# Altium project Nav-HAT.PrjPcb
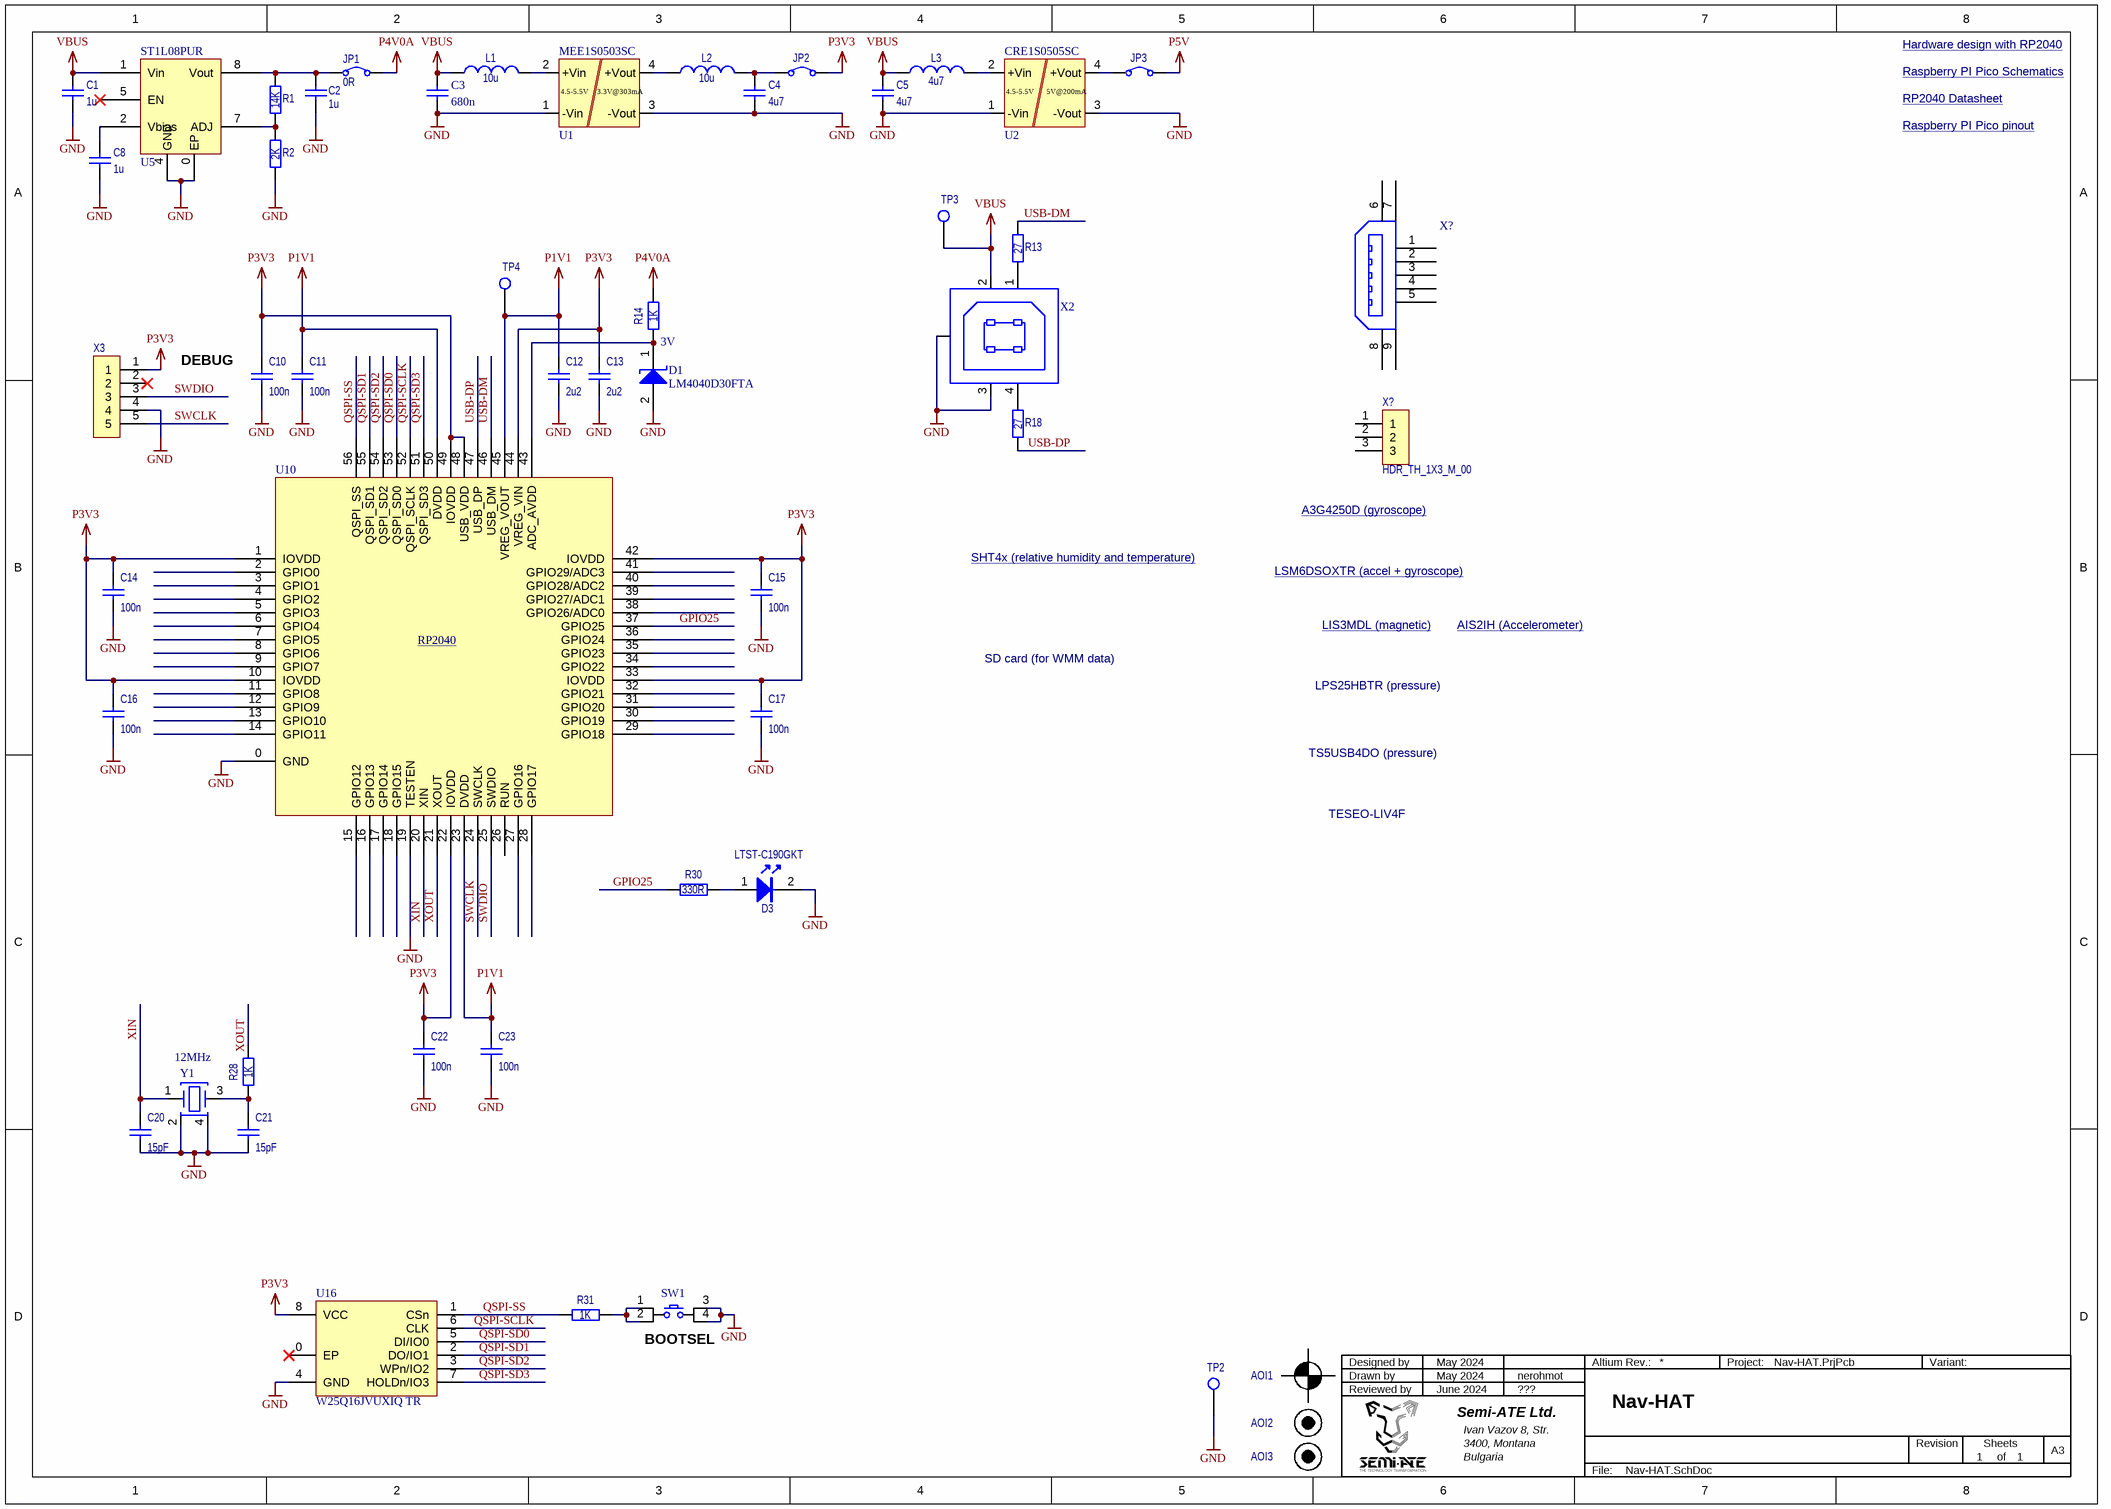
[diagram p0: Nav-HAT.SchDoc]
Project_Title: Nav-HAT; Engineer_Review: ???; Engineer_Drawn: nerohmot; Engineer_Desing: nerohmot; Date_Reviewed: June 2024; Date_Drawn: May 2024; Date_Designed: May 2024
1 sheet, 51 parts. Net scope: global (net labels, ports and power ports of the same name join across sheets).
Board file: Nav-HAT.PcbDoc

## Sheet Nav-HAT.SchDoc
size A3; SheetNumber: 1; SheetTotal: 1

### Parts
(Parts that share a designator on the sheet are numbered #1, #2 ... from top to bottom, then left to right.)
AOI1  FIDUCIAL_MARKER_CROSS  [FIDUCIAL_MARKER_CROSS]  (value not drawn)  (no BOM)
AOI2  FIDUCIAL_MARKER_POINT  [FIDUCIAL_MARKER_POINT]  (value not drawn)  (no BOM)
AOI3  FIDUCIAL_MARKER_POINT  [FIDUCIAL_MARKER_POINT]  (value not drawn)  (no BOM)
C1  value 1u  [CAPC0402]  (hidden comment: CL05A105KP5NNNC)
C2  value 1u  [CAPC0402]  (hidden comment: CL05A105KP5NNNC)
C3  value 680n  [CAPC0603]  (hidden comment: 680n_0603_25V_X7R_10%)
C4  value 4u7  [CAPC0402]  (hidden comment: CL05A475KP5NRNC)
C5  value 4u7  [CAPC0402]  (hidden comment: CL05A475KP5NRNC)
C8  value 1u  [CAPC0402]  (hidden comment: CL05A105KP5NNNC)
C10  value 100n  [CAPC0402]  (hidden comment: C0402C104J8RACTU)
C11  value 100n  [CAPC0402]  (hidden comment: C0402C104J8RACTU)
C12  value 2u2  [CAPC0402]  (hidden comment: CC0402KRX7R8BB102)
C13  value 2u2  [CAPC0402]  (hidden comment: CC0402KRX7R8BB102)
C14  value 100n  [CAPC0402]  (hidden comment: C0402C104J8RACTU)
C15  value 100n  [CAPC0402]  (hidden comment: C0402C104J8RACTU)
C16  value 100n  [CAPC0402]  (hidden comment: C0402C104J8RACTU)
C17  value 100n  [CAPC0402]  (hidden comment: C0402C104J8RACTU)
C20  value 15pF  [CAPC0402]  (hidden comment: GJM1555C1H3R0BB01D)
C21  value 15pF  [CAPC0402]  (hidden comment: GJM1555C1H3R0BB01D)
C22  value 100n  [CAPC0402]  (hidden comment: C0402C104J8RACTU)
C23  value 100n  [CAPC0402]  (hidden comment: C0402C104J8RACTU)
D1  LM4040D30FTA  value 3V  [SOT23-3]
D3  LTST-C190GKT  [LED0603G]
JP1  value 0R  [JumperSMD_0603]  (hidden comment: 5110 Keystone)  (no BOM)
JP2  5110 Keystone  [JumperSMD_0603]  (value not drawn)  (no BOM)
JP3  5110 Keystone  [JumperSMD_0603]  (value not drawn)  (no BOM)
L1  value 10u  [INDC1210]  (hidden comment: AISC-0603F-1R0J-T)
L2  value 10u  [INDC1210]  (hidden comment: AISC-0603F-1R0J-T)
L3  value 4u7  [INDC1210]  (hidden comment: INDC_4u7_1210_800mA_20%)
R1  value 14K  [RESC0402]  (hidden comment: CRCW040214K3FKED)
R2  value 2K  [RESC0402]  (hidden comment: CRCW040214K3FKED)
R13  value 27  [RESC0402]  (hidden comment: CRCW040214K3FKED)
R14  value 1K  [RESC0402]  (hidden comment: RC0402FR-071KL)
R18  value 27  [RESC0402]  (hidden comment: CRCW040214K3FKED)
R28  value 1K  [RESC0402]  (hidden comment: RC0402FR-071KL)
R30  value 330R  [RESC0402]  (hidden comment: RC0402FR-07330RL)
R31  value 1K  [RESC0402]  (hidden comment: RC0402FR-071KL)
SW1  434133025816  [434133025816]  (value not drawn)
TP2  Keystone Electronics 5011  [TP_TH_1.6mm_BLACK_OVAL]  (value not drawn)  (no BOM)
TP3  TP_TH_PROBE_0.8mm  [TP_TH_PROBE_0.8mm]  (value not drawn)  (no BOM)
TP4  TP_TH_PROBE_0.8mm  [TP_TH_PROBE_0.8mm]  (value not drawn)  (no BOM)
U1  MEE1S0503SC  [MEE1SXXXXSC]
U2  CRE1S0505SC  [CRE1SXXXXCS]
U5  ST1L08PUR  [DFN8 (2x3)]
U10  RP2040  [QFN56_7X7_RPI]  (value not drawn)
U16  W25Q16JVUXIQ TR  [USON-8_UX_2x3x0p6_WIN]
X2  1-1734346-1  [CONN_1-1734346-1_TYCO]  (value not drawn)
X3  22-29-2051  [HDR_TH_1X5_M_00_LOCK]  (value not drawn)
X?#1  1734327-1  [1734327-1]  (value not drawn)
X?#2  value HDR_TH_1X3_M_00  [HDR_TH_1X3_M_00]  (hidden comment: 825433-3)
Y1  value 12MHz  [ABM8]  (hidden comment: ABM8-272-T3)

### Nets
GND: C1.1 C2.1 C3.1 C4.1 C5.1 C8.1 C10.1 C11.1 C12.1 C13.1 C14.1 C15.1 C16.1 C17.1 C20.1 C21.1 C22.1 C23.1 D1.2(Anode) D3.2(K) R2.1 SW1.3 SW1.4 TP2.0 U1.1(-Vin) U1.3(-Vout) U2.1(-Vin) U2.3(-Vout) U5.0(EP) U5.4(GND) U10.0(GND) U10.19(TESTEN) U16.4(GND) X2.3(GND) X2.5(SHIELD) X3.4 Y1.2(GND) Y1.4(GND)
P1V1: C11.2 C12.2 C23.2 TP4.0 U10.23(DVDD) U10.45(VREG_VOUT) U10.50(DVDD)
P3V3: C10.2 C13.2 C14.2 C15.2 C16.2 C17.2 C22.2 JP2.2 U10.1(IOVDD) U10.10(IOVDD) U10.22(IOVDD) U10.33(IOVDD) U10.42(IOVDD) U10.44(VREG_VIN) U10.48(USB_VDD) U10.49(IOVDD) U16.8(VCC) X3.1
P4V0A: JP1.2 R14.2
P5V: JP3.2
VBUS: C1.2 C3.2 C5.2 L1.1 L3.1 TP3.0 U5.1(Vin) X2.2(VBUS)
GPIO25: R30.1 U10.37(GPIO25)
QSPI-SCLK: U10.52(QSPI_SCLK) U16.6(CLK)
QSPI-SD0: U10.53(QSPI_SD0) U16.5(DI/IO0)
QSPI-SD1: U10.55(QSPI_SD1) U16.2(DO/IO1)
QSPI-SD2: U10.54(QSPI_SD2) U16.3(WPn/IO2)
QSPI-SD3: U10.51(QSPI_SD3) U16.7(HOLDn/IO3)
QSPI-SS: R31.1 U10.56(QSPI_SS) U16.1(CSn)
SWCLK: U10.24(SWCLK) X3.5
SWDIO: U10.25(SWDIO) X3.3
USB-DM: R13.2 U10.46(USB_DM)
USB-DP: R18.2 U10.47(USB_DP)
XIN: C20.2 U10.20(XIN) Y1.1(IN)
XOUT: R28.2 U10.21(XOUT)
NetC2_2: C2.2 JP1.1 R1.2 U5.8(Vout)
NetC4_2: C4.2 JP2.1 L2.2
NetC8_2: C8.2 U5.2(Vbias)
NetC21_2: C21.2 R28.1 Y1.3(OUT)
NetD1_1: D1.1(Cathode) R14.1 U10.43(ADC_AVDD)
NetD3_1: D3.1(A) R30.2
NetJP3_1: JP3.1 U2.4(+Vout)
NetL1_2: L1.2 U1.2(+Vin)
NetL2_1: L2.1 U1.4(+Vout)
NetL3_2: L3.2 U2.2(+Vin)
NetR1_1: R1.1 R2.2 U5.7(ADJ)
NetR13_1: R13.1 X2.1(D-)
NetR18_1: R18.1 X2.4(D+)
NetR31_2: R31.2 SW1.1 SW1.2

Not connected (* = marked no-connect by the designer): U5 5(EN)*; U10 2(GPIO0) 3(GPIO1) 4(GPIO2) 5(GPIO3) 6(GPIO4) 7(GPIO5) 8(GPIO6) 9(GPIO7) 11(GPIO8) 12(GPIO9) 13(GPIO10) 14(GPIO11) 15(GPIO12) 16(GPIO13) 17(GPIO14) 18(GPIO15) 26(RUN) 27(GPIO16) 28(GPIO17) 29(GPIO18) 30(GPIO19) 31(GPIO20) 32(GPIO21) 34(GPIO22) 35(GPIO23) 36(GPIO24) 38(GPIO26/ADC0) 39(GPIO27/ADC1) 40(GPIO28/ADC2) 41(GPIO29/ADC3); U16 0(EP)*; X3 2*; X?#1 1 2 3 4 5 6 7 8 9; X?#2 1 2 3

### Notes on the sheet
- Hardware design with RP2040 <https://datasheets.raspberrypi.com/rp2040/hardware-design-with-rp2040.pdf>
- Raspberry PI Pico Schematics <https://proto-pic.co.uk/content/RPI-PICO-R3-PUBLIC-SCHEMATIC.pdf>
- RP2040 Datasheet <https://datasheets.raspberrypi.com/rp2040/rp2040-datasheet.pdf>
- Raspberry PI Pico pinout <https://www.raspberrypi.com/documentation/microcontrollers/images/pico-pinout.svg>
- (near C10) DEBUG
- A3G4250D (gyroscope) <https://www.st.com/en/mems-and-sensors/a3g4250d.html>
- SHT4x (relative humidity and temperature) <https://www.farnell.com/datasheets/3902978.pdf>
- LSM6DSOXTR (accel + gyroscope) <file:///D:/Downloads/lsm6dsox.pdf>
- (near U10) RP2040 <https://datasheets.raspberrypi.com/rp2040/rp2040-datasheet.pdf>
- LIS3MDL (magnetic) <https://www.st.com/en/mems-and-sensors/lis3mdl.html>
- AIS2IH (Accelerometer) <https://www.st.com/resource/en/datasheet/ais2ih.pdf>
- SD card (for WMM data)
- LPS25HBTR (pressure)
- TS5USB4DO (pressure)
- TESEO-LIV4F
- (near SW1) BOOTSEL
- Designed by
- Reviewed by
- Drawn by
- Semi-ATE Ltd.
- Altium Rev.:
- Project:
- Variant:
- Bulgaria
- 3400, Montana
- Ivan Vazov 8, Str.
- File:
- Revision
- Sheets
- of
- A3
- (in symbol CRE1S0505SC) 4.5-5.5V; 5V@200mA
- (in symbol MEE1S0503SC) 4.5-5.5V; 3.3V@303mA

### Library data of the parts
AOI1 = FIDUCIAL_MARKER_CROSS: Assembly AOI; Manufacturer: *; Manufacturer  Part Number: *; Supplier 1: *; Supplier Part Number 1: *; Value: FIDUCIAL_MARKER_CROSS
AOI2 AOI3 = FIDUCIAL_MARKER_POINT: Assembly AOI; Manufacturer: *; Manufacturer  Part Number: *; Supplier 1: *; Supplier Part Number 1: *; Value: FIDUCIAL_MARKER_POINT
C1 C2 C8 = 1u_0402_10V_X5R_10%: Capacitor; Ceramic; 1u; 0402; 10V; X5R; 10%; -55°C ~ 85°C; Manufacturer: Samsung Electro-Mechanics; Manufacturer Part Number: CL05A105KP5NNNC; Supplier 1: DigiKey; Supplier Part Number 1: 1276-1076-6-ND; ComponentLink1Description: Datasheet; ComponentLink1URL: https://www.samsungsem.com/resources/file/global/support/product_catalog/MLCC.pdf; ComponentLink2Description: Supplier Info; ComponentLink2URL: https://www.digikey.com/en/products/detail/samsung-electro-mechanics/CL05A105KP5NNNC/3886734?s=N4IgTCBcDaIIxgOwDYC0cAMLVoHIBEQBdAXyA
C3 = 680n_0603_25V_X7R_10%: Capacitor; Ceramic; 0.68u; 0603; 25V; X7R; 10%; -55°C ~ 125°C; Manufacturer: YAGEO; Manufacturer Part Number: CC0603KRX7R8BB684; ComponentLink1Description: Datasheet; ComponentLink1URL: https://www.yageo.com/upload/media/product/productsearch/datasheet/mlcc/UPY-GPHC_X7R_6.3V-to-250V_24.pdf; ComponentLink2Description: Supplier Info; ComponentLink2URL: https://www.digikey.de/en/products/detail/yageo/CC0603KRX7R8BB684/16797741; Supplier 1: Digi-Key; Supplier Part Number 1: 13-CC0603KRX7R8BB684CT-ND
C4 C5 = 4u7_0402_10V_X5R_10%: Capacitor; Ceramic; 4.7u; 0402; 10V; X5R; 10%; -55°C ~ 85°C; Manufacturer: Samsung Electro-Mechanics; Manufacturer Part Number: CL05A475KP5NRNC; Supplier 1: DigiKey; Supplier Part Number 1: 1276-1480-6-ND; ComponentLink1Description: Datasheet; ComponentLink1URL: https://media.digikey.com/pdf/Data%20Sheets/Samsung%20PDFs/CL05A475KP5NRNC_Spec.pdf; ComponentLink2Description: Supplier Info; ComponentLink2URL: https://www.digikey.com/en/products/detail/samsung-electro-mechanics/CL05A475KP5NRNC/3887138?s=N4IgTCBcDaIIxgOwDYC0cAsAOADKtAcgCIgC6AvkA
C10 C11 C14-C17 C22 C23 = 100n_0402_10V_X7R_5%: Capacitor; Ceramic; 100n; 0402; 10V; X7R; 5%; -55°C ~ 125°C; Manufacturer: KEMET; Manufacturer Part Number: C0402C104J8RACTU; Supplier 1: DigiKey; Supplier Part Number 1: 399-8942-6-ND; ComponentLink1Description: Datasheet; ComponentLink1URL: https://content.kemet.com/datasheets/KEM_C1002_X7R_SMD.pdf; ComponentLink2Description: Supplier Info; ComponentLink2URL: https://www.digikey.com/en/products/detail/kemet/C0402C104J8RACTU/2196231?s=N4IgTCBcDaIMwE4EFoAcCAsZkDZkDkAREAXQF8g
C12 C13 = 2u2_0402_50V_X5R_10%: Capacitor; Ceramic; 2u2; 0402; 50V; X5R; 10%; -55°C ~ 85°C; Manufacturer: Murata Electronics; Manufacturer Part Number: GRM155R61H222KA01D; Supplier 1: DigiKey; Supplier Part Number 1: 490-8257-1-ND; ComponentLink1Description: Datasheet; ComponentLink1URL: https://search.murata.co.jp/Ceramy/image/img/A01X/G101/ENG/GRM155R61H222KA01-01.pdf; ComponentLink2Description: Supplier Info; ComponentLink2URL: https://www.digikey.de/en/products/detail/murata-electronics/GRM155R61H222KA01D/2610873
C20 C21 = 15p_0402_25V_C0G/NP0_5%: Capacitor; Ceramic; 15p; 0402; 25V; C0G/NP0; +/-5%; -55°C ~ 125°C; Manufacturer: YAGEO; Manufacturer Part Number: CC0402JRNPO8BN150; Supplier 1: DigiKey; Supplier Part Number 1: 311-3746-1-ND; ComponentLink1Description: Datasheet; ComponentLink1URL: https://www.yageo.com/upload/media/product/productsearch/datasheet/mlcc/UPY-GP_NP0_16V-to-50V_18.pdf; ComponentLink2Description: Supplier Info; ComponentLink2URL: https://www.digikey.de/en/products/detail/yageo/CC0402JRNPO8BN150/5883268
D1 = LM4040D30FTA: Shunt Voltage Reference IC Fixed 3V ±1% 15 mA SOT-23-3; Manufacturer: Diodes Incorporated; ComponentLink1Description: Datasheet; ComponentLink1URL: https://www.diodes.com/assets/Datasheets/LM4040.pdf; ComponentLink2Description: Supplier Info; ComponentLink2URL: https://www.digikey.de/en/products/detail/diodes-incorporated/LM4040D30FTA/4249974; Manufacturer Part Number: LM4040D30FTA; Supplier 1: Digi-Key; Supplier Part Number 1: LM4040D30FTADICT-ND
D3 = LED_GN_LTST-C190GKT: LED; Green; 571nm; SMD; 0603; Manufacturer: Lite-On Inc.; Manufacturer Part Number: LTST-C190GKT; ComponentLink4Description: Supplier Info; ComponentLink4URL: https://www.digikey.de/en/products/detail/liteon/LTST-C190GKT/269230; ComponentLink5Description: Datasheet; ComponentLink5URL: https://mm.digikey.com/Volume0/opasdata/d220001/medias/docus/858/LTST-C190GKT.pdf; Supplier 1: Digi-Key; Supplier Part Number 1: LTST-C190GKT; Value: LTST-C190GKT
JP1-JP3 = JMP_0R_0603: Jumper; Chip; 0R; 0603; 500mW; Manufacturer Part Number: 5110; ComponentLink1Description: Datasheet; ComponentLink1URL: https://www.keyelco.com/userAssets/file/M65p54.pdf; ComponentLink2Description: Supplier Info; ComponentLink2URL: https://www.digikey.com/en/products/detail/keystone-electronics/5110/5118870?s=N4IgTCBcDaINIFMCeBnALgewHYIAQFYBGQgBhAF0BfIA; Manufacturer: Keystone; Supplier 1: Digi-Key; Supplier Part Number 1: 36-5110CT-ND
  JP2 JP3: Value: 0R
L1 L2 = INDC_10u_1210_500mA_10%: Inductor; Chip; Unshielded; 10uH; 10%; 500mA; 400mR; 1210; Manufacturer: Murata Power Solutions Inc.; Manufacturer Part Number: 82103C; ComponentLink1Description: Supplier Info; ComponentLink1URL: https://search.murata.co.jp/Ceramy/image/img/P02A/kmp_8200c.pdf; ComponentLink2Description: Datasheet; ComponentLink2URL: https://www.digikey.de/en/products/detail/murata-power-solutions-inc/82103C/3178927?s=N4IgTCBcDaIBxgIwAYDMBhEBdAvkA; Supplier 1: Digi-Key; Supplier Part Number 1: 811-2473-1-ND
L3 = INDC_4u7_1210_800mA_20%: Inductor; Chip; Unshielded; 4.7uH; 20%; 800mA; 190mR; 1210; Manufacturer: Murata Power Solutions Inc.; Manufacturer Part Number: 82472C; ComponentLink1Description: Supplier Info; ComponentLink1URL: https://search.murata.co.jp/Ceramy/image/img/P02A/kmp_8200c.pdf; ComponentLink2Description: Datasheet; ComponentLink2URL: https://www.digikey.de/en/products/detail/murata-power-solutions-inc/82103C/3178927?s=N4IgTCBcDaIBxgIwAYDMBhEBdAvkA; Supplier 1: Digi-Key; Supplier Part Number 1: 811-2471-1-ND
R1 = 14K_0402_63mW_1%_100ppm: Resistor; Chip; 14k; 0402; 1%; 100ppm; 63mW; -55°C ~ 155°C; Manufacturer: YAGEO; Manufacturer Part Number: RC0402FR-0714KL; Supplier 1: DigiKey; Supplier Part Number 1: 311-14.0KLRCT-ND; ComponentLink1Description: Datasheet; ComponentLink1URL: https://www.yageo.com/upload/media/product/products/datasheet/rchip/PYu-RC_Group_51_RoHS_L_12.pdf; ComponentLink2Description: Supplier Info; ComponentLink2URL: https://www.digikey.de/en/products/detail/yageo/RC0402FR-0714KL/726540
R2 = 2K_0402_63mW_1%_100ppm: Resistor; Chip; 2k; 0402; 1%; 100ppm; 63mW; -55°C ~ 155°C; Manufacturer: YAGEO; Manufacturer Part Number: RC0402FR-072KL; Supplier 1: DigiKey; Supplier Part Number 1: 311-2KLRCT-ND; ComponentLink1Description: Datasheet; ComponentLink1URL: https://www.yageo.com/upload/media/product/products/datasheet/rchip/PYu-RC_Group_51_RoHS_L_12.pdf; ComponentLink2Description: Supplier Info; ComponentLink2URL: https://www.digikey.de/en/products/detail/yageo/RC0402FR-072KL/2827565
R13 R18 = 27R_0402_63mW_1%_100ppm: Resistor; Chip; 27Ohm; 0402; 1%; 100ppm; 63mW; -55°C ~ 155°C; Manufacturer: YAGEO; Manufacturer Part Number: RC0402FR-0727RL; Supplier 1: DigiKey; Supplier Part Number 1: YAG3086CT-ND; ComponentLink1Description: Datasheet; ComponentLink1URL: https://www.yageo.com/upload/media/product/products/datasheet/rchip/PYu-RC_Group_51_RoHS_L_12.pdf; ComponentLink2Description: Supplier Info; ComponentLink2URL: https://www.digikey.de/en/products/detail/yageo/RC0402FR-0727RL/5280946
R14 R28 R31 = 1K_0402_63mW_1%_100ppm: Resistor; Chip; 1k; 0402; 50V; 1%; 100ppm; 63mW; -55°C ~ 155°C; Manufacturer: Yageo; Manufacturer Part Number: RC0402FR-071KL; Supplier 1: DigiKey; Supplier Part Number 1: 311-1.00KLRDKR-ND; ComponentLink1Description: Datasheet; ComponentLink1URL: https://www.yageo.com/upload/media/product/productsearch/datasheet/rchip/PYu-RC_Group_51_RoHS_L_11.pdf; ComponentLink2Description: Supplier Info; ComponentLink2URL: https://www.digikey.com/en/products/detail/yageo/RC0402FR-071KL/726513?s=N4IgTCBcDaIMwEYEFoEDoAMGDSAZASgCLb7IByhIAugL5A
R30 = 330R_0402_63mW_1%_100ppm: Resistor; Chip; 330R; 0402; 50V; 1%; 100ppm; 63mW; -55°C ~ 155°C; Manufacturer: Yageo; Manufacturer Part Number: RC0402FR-07330RL; Supplier 1: DigiKey; Supplier Part Number 1: 311-330LRDKR-ND; ComponentLink1Description: Datasheet; ComponentLink1URL: https://www.yageo.com/upload/media/product/productsearch/datasheet/rchip/PYu-RC_Group_51_RoHS_L_11.pdf; ComponentLink2Description: Supplier Info; ComponentLink2URL: https://www.digikey.com/en/products/detail/yageo/RC0402FR-07330RL/726594?s=N4IgTCBcDaIMwEYEFo5wAwBkBKARA0tsgHK4gC6AvkA
SW1 = 434133025816: SWITCH TACTILE SPST-NO 0.05A 16V; Manufacturer: Würth Elektronik; ComponentLink1Description: Datasheet; ComponentLink1URL: https://www.we-online.com/components/products/datasheet/434133025816.pdf; ComponentLink2Description: Supplier Info; ComponentLink2URL: https://www.digikey.de/en/products/detail/w%C3%BCrth-elektronik/434133025816/9950810?s=N4IgTCBcDaICwGY4EYEIAxgKwA5kDYQBdAXyA; Manufacturer Part Number: 434133025816; Supplier 1: Digi-Key; Supplier Part Number 1: 732-13663-1-ND
TP2 = TP_TH_1.6mm_BLACK_OVAL: Test Point, TH, Black, 1.6mm hole; Manufacturer Part Number 1: 5011; Manufacturer: Keystone Electronics; Value: TP_TH_1.6mm_BLACK_OVAL; Supplier 1: Digi-Key; Supplier Part Number 1: 36-5011-ND; ComponentLink1Description: Supplier Info; ComponentLink1URL: https://www.digikey.com/en/products/detail/keystone-electronics/5011/255333?s=N4IgTCBcDaIMwDYC0BWADARg0gcgERAF0BfIA; ComponentLink2Description: Datasheet; ComponentLink2URL: https://www.keyelco.com/userAssets/file/M65p56.pdf
TP3 TP4 = TP_TH_PROBE_0.8mm: Test Point, TH for Probe, 0.8mm hole; Manufacturer: *; Manufacturer Part Number 1: *; Supplier 1: *; Supplier Part Number 1: *; Value: TP_TH_PROBE_0.8mm
U1 = MEE1S0503SC: Isolated DC/DC Module 4.5V - 5.5V -> 3.3V@303mA; Manufacturer: Murata Power Solutions Inc.; ComponentLink1Description: Datasheet; ComponentLink1URL: https://www.murata.com/products/productdata/8807029669918/kdc-mee1.pdf; ComponentLink2Description: Supplier Info; ComponentLink2URL: https://www.digikey.de/en/products/detail/murata-power-solutions-inc/MEE1S0503SC/3511361; Manufacturer Part Number: MEE1S0503SC; Supplier 1: Digi-Key; Supplier Part Number 1: 811-2738-ND; Value: MEE1S0503SC
U2 = CRE1S0505SC: Isolated DC/DC Module 4.5V - 5.5V -> 5V@200mA; Manufacturer: Murata Power Solutions Inc.; ComponentLink1Description: Datasheet; ComponentLink1URL: https://www.murata.com/products/productdata/8807029407774/kdc-cre1.pdf; ComponentLink2Description: Supplier Info; ComponentLink2URL: https://www.digikey.de/en/products/detail/murata-power-solutions-inc/CRE1S0505SC/6056052; Manufacturer Part Number: CRE1S0505SC; Supplier 1: Digi-Key; Supplier Part Number 1: 811-3196-ND; Value: CRE1S0505SC
U5 = ST1L08PUR: IC REG LINEAR POS ADJ 800MA 8DFN; Manufacturer: STMicroelectronics; ComponentLink1Description: Datasheet; ComponentLink1URL: https://www.st.com/content/ccc/resource/technical/document/datasheet/5f/25/d1/3f/f8/25/44/07/DM00123507.pdf/files/DM00123507.pdf/jcr:content/translations/en.DM00123507.pdf; ComponentLink2Description: Supplier Info; ComponentLink2URL: https://www.digikey.de/en/products/detail/stmicroelectronics/ST1L08PUR/5131805; Supplier 1: Digi-Key; Supplier Part Number 1: 497-15223-1-ND; Manufacturer Part Number: ST1L08PUR
U10 = RP2040: IC MCU 32BIT EXT MEM 56QFN; Manufacturer: Raspberry Pi; Manufacturer Part Number: SC0914(13); ComponentLink1Description: Datasheet; ComponentLink1URL: https://datasheets.raspberrypi.com/rp2040/rp2040-datasheet.pdf; ComponentLink2Description: Supplier Info; ComponentLink2URL: https://www.digikey.de/en/products/detail/raspberry-pi/SC0914-13/14306010?s=N4IgTCBcDaIE4AcwAYAsyQF0C%2BQ; Supplier 1: Digi-Key; Supplier Part Number 1: 2648-SC0914(13)CT-ND; Value: RP2040
U16 = W25Q16JVUXIQ TR: IC FLASH 16MBIT SPI/QUAD 8USON; Manufacturer: Winbond Electronics; ComponentLink1Description: Datasheet; ComponentLink1URL: https://www.winbond.com/resource-files/w25q16jv%20spi%20revh%2004082019%20plus.pdf; ComponentLink2Description: Supplier Info; ComponentLink2URL: https://www.digikey.de/en/products/detail/winbond-electronics/W25Q16JVUXIQ-TR/15182017; Manufacturer Part Number: W25Q16JVUXIQ TR; Supplier 1: Digi-Key; Supplier Part Number 1: 256-W25Q16JVUXIQTRCT-ND; Value: W25Q16JVUXIQ TR
X2 = 1-1734346-1: USB-B (USB TYPE-B) USB 2.0 Receptacle Connector 4 Position Surface Mount, Right Angle; Manufacturer: TE Connectivity AMP Connectors; ComponentLink1Description: Supplier Info; ComponentLink1URL: https://www.digikey.de/en/products/detail/te-connectivity-amp-connectors/1-1734346-1/2286644; ComponentLink2Description: Datasheet; ComponentLink2URL: https://www.te.com/commerce/DocumentDelivery/DDEController?Action=srchrtrv&DocNm=1734346&DocType=Customer+Drawing&DocLang=English; Manufacturer Part Number: 1-1734346-1; Supplier 1: Digi-Key; Supplier Part Number 1: A110862CT-ND
X3 = HDR_TH_1X5_M_00_LOCK: Header; 1x5 pins; Male; Straight; Pitch 2.54mm; Lock Funcion; Board to Cable/Wire; Manufacturer: Molex; ComponentLink1Description: Supplier Info; ComponentLink1URL: https://www.digikey.de/products/en?keywords=WM2747-ND; ComponentLink2Description: Datasheet; ComponentLink2URL: https://www.molex.com/pdm_docs/sd/022292051_sd.pdf; Manufacturer Part Number: 22-29-2051; Supplier 1: Digi-Key; Supplier Part Number 1: 23-0022292051-ND; Value: HDR_TH_1X5_M_00_LOCK
X?#1 = 1734327-1: USB - mini A USB 2.0 Receptacle Connector 5 Position Surface Mount, Right Angle; Manufacturer: TE Connectivity AMP Connectors; ComponentLink1Description: Datasheet; ComponentLink1URL: https://www.mouser.de/datasheet/2/418/7/ENG_CD_1734327_D1-2016926.pdf; ComponentLink2Description: Supplier Info; ComponentLink2URL: https://www.digikey.de/en/products/detail/te-connectivity-amp-connectors/1734327-1/1891548; Manufacturer Part Number: 1734327-1; Supplier 1: Digi-Key; Supplier Part Number 1: A123107-ND; Value: 1734327-1
X?#2 = HDR_TH_1X3_M_00: Header; 1x3 pins; Male; Straight; Pitch 2.54mm; Manufacturer: TE Connectivity; Manufacturer Part Number: 825433-2; ComponentLink1Description: Supplier Info; ComponentLink1URL: https://www.digikey.de/product-detail/en/te-connectivity-amp-connectors/825433-3/A106465-ND/2054408; ComponentLink2Description: Datasheet; ComponentLink2URL: https://www.te.com/commerce/DocumentDelivery/DDEController?Action=srchrtrv&DocNm=825433&DocType=Customer+Drawing&DocLang=English; Supplier 1: Digi-Key; Supplier Part Number 1: A106465-ND
Y1 = ABM8-272-T3: Christal; SMD; 12 MHz ±30ppm; 10pF/50Ohm; Manufacturer: Abracon LLC; ComponentLink1Description: Datasheet; ComponentLink1URL: https://mm.digikey.com/Volume0/opasdata/d220001/medias/docus/6128/ABM8-272-T3.pdf; ComponentLink2Description: Supplier Info; ComponentLink2URL: https://www.digikey.de/en/products/detail/abracon-llc/ABM8-272-T3/22472366; Manufacturer Part Number: ABM8-272-T3; Supplier 1: Digi-Key; Supplier Part Number 1: 535-ABM8-272-T3CT-ND

## Assembly variants
HAT: all parts fitted
NMEA2000: all parts fitted